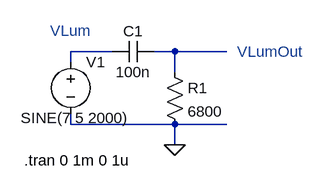
[diagram p0: schematic passe haut.asc]
passe haut.asc, the LTspice schematic file:
Version 4.1
SHEET 1 880 680
WIRE 128 112 64 112
WIRE 224 112 192 112
WIRE 304 112 224 112
WIRE 64 128 64 112
WIRE 224 144 224 112
WIRE 64 224 64 208
WIRE 224 224 64 224
WIRE 304 224 224 224
WIRE 224 256 224 224
FLAG 224 256 0
SYMBOL cap 192 96 R90
WINDOW 0 0 32 VBottom 2
WINDOW 3 32 32 VTop 2
SYMATTR InstName C1
SYMATTR Value 100n
SYMBOL res 208 128 R0
SYMATTR InstName R1
SYMATTR Value 6800
SYMBOL voltage 64 112 R0
WINDOW 3 -77 102 Left 2
WINDOW 123 0 0 Left 0
WINDOW 39 0 0 Left 0
SYMATTR Value SINE(7 5 2000)
SYMATTR InstName V1
TEXT 32 80 Left 2 ;VLum
TEXT 320 112 Left 2 ;VLumOut
TEXT -8 280 Left 2 !.tran 0 1m 0 1u

The netlist it stands for:
* passe haut.asc
C1 N002 N001 100n
R1 N002 0 6800
V1 N001 0 SINE(7 5 2000)
* VLum
* VLumOut
.tran 0 1m 0 1u
.backanno
.end